# EasyEDA Pro project osc_gener.eprj, board 示波发生
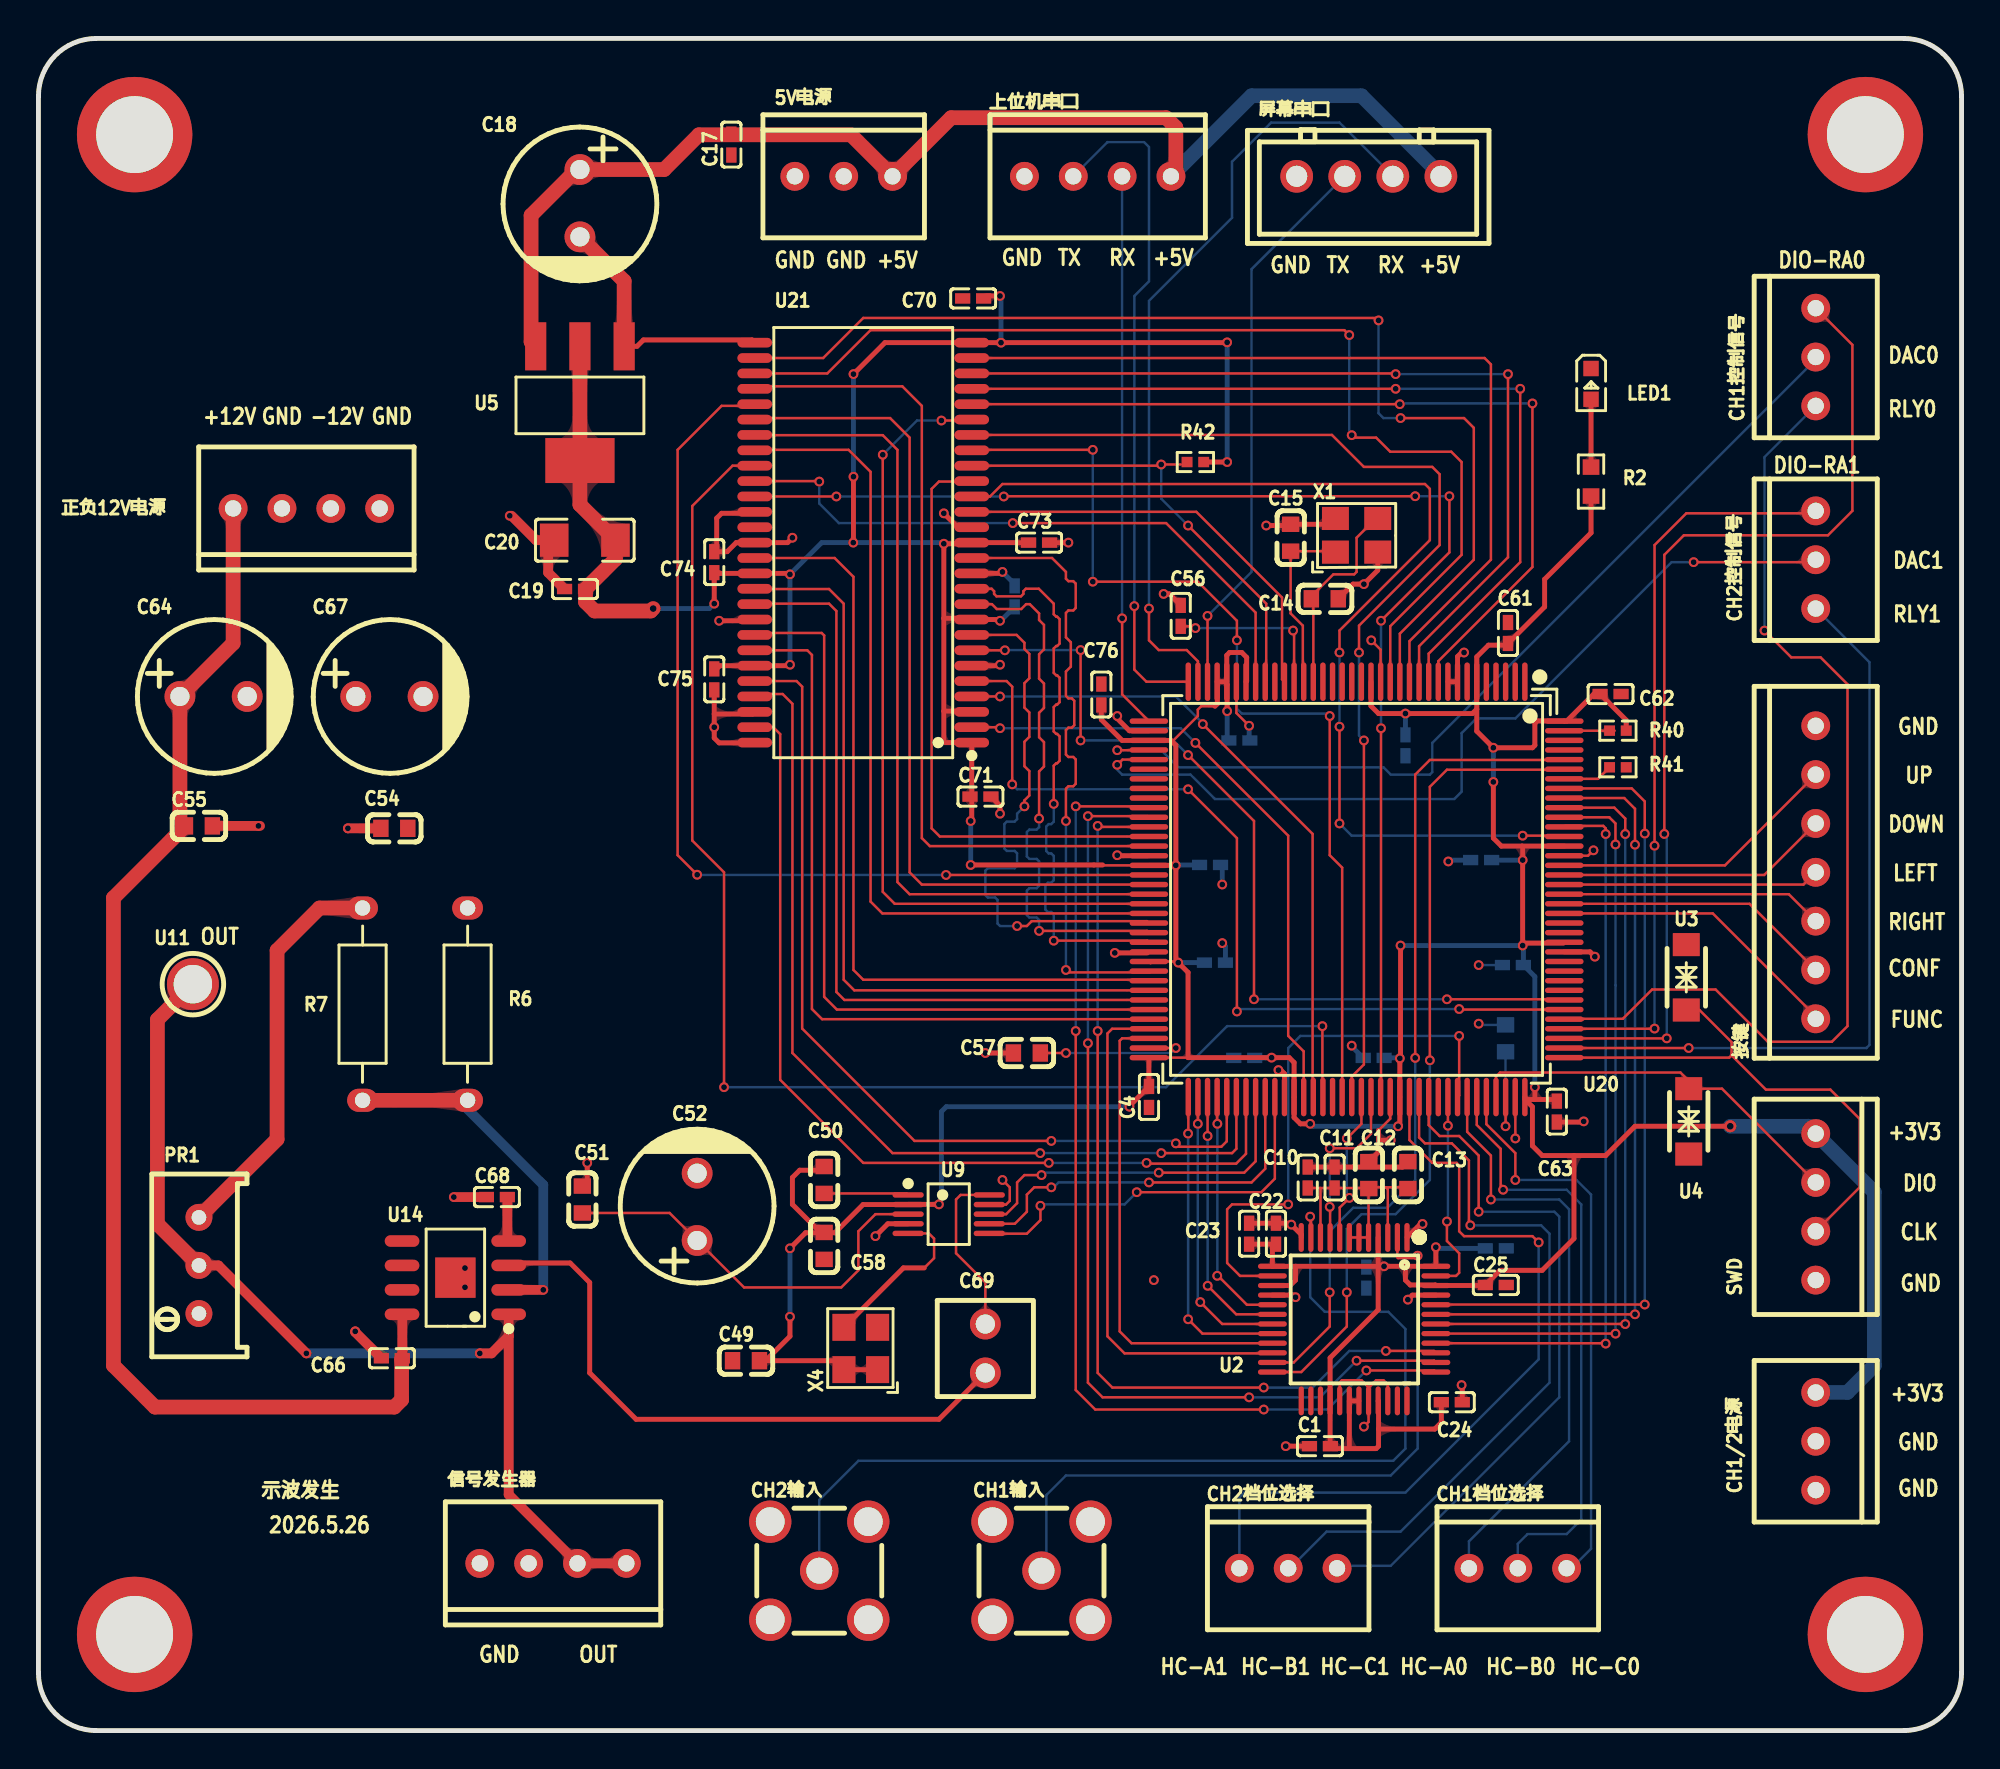
[diagram p8: board, top side]
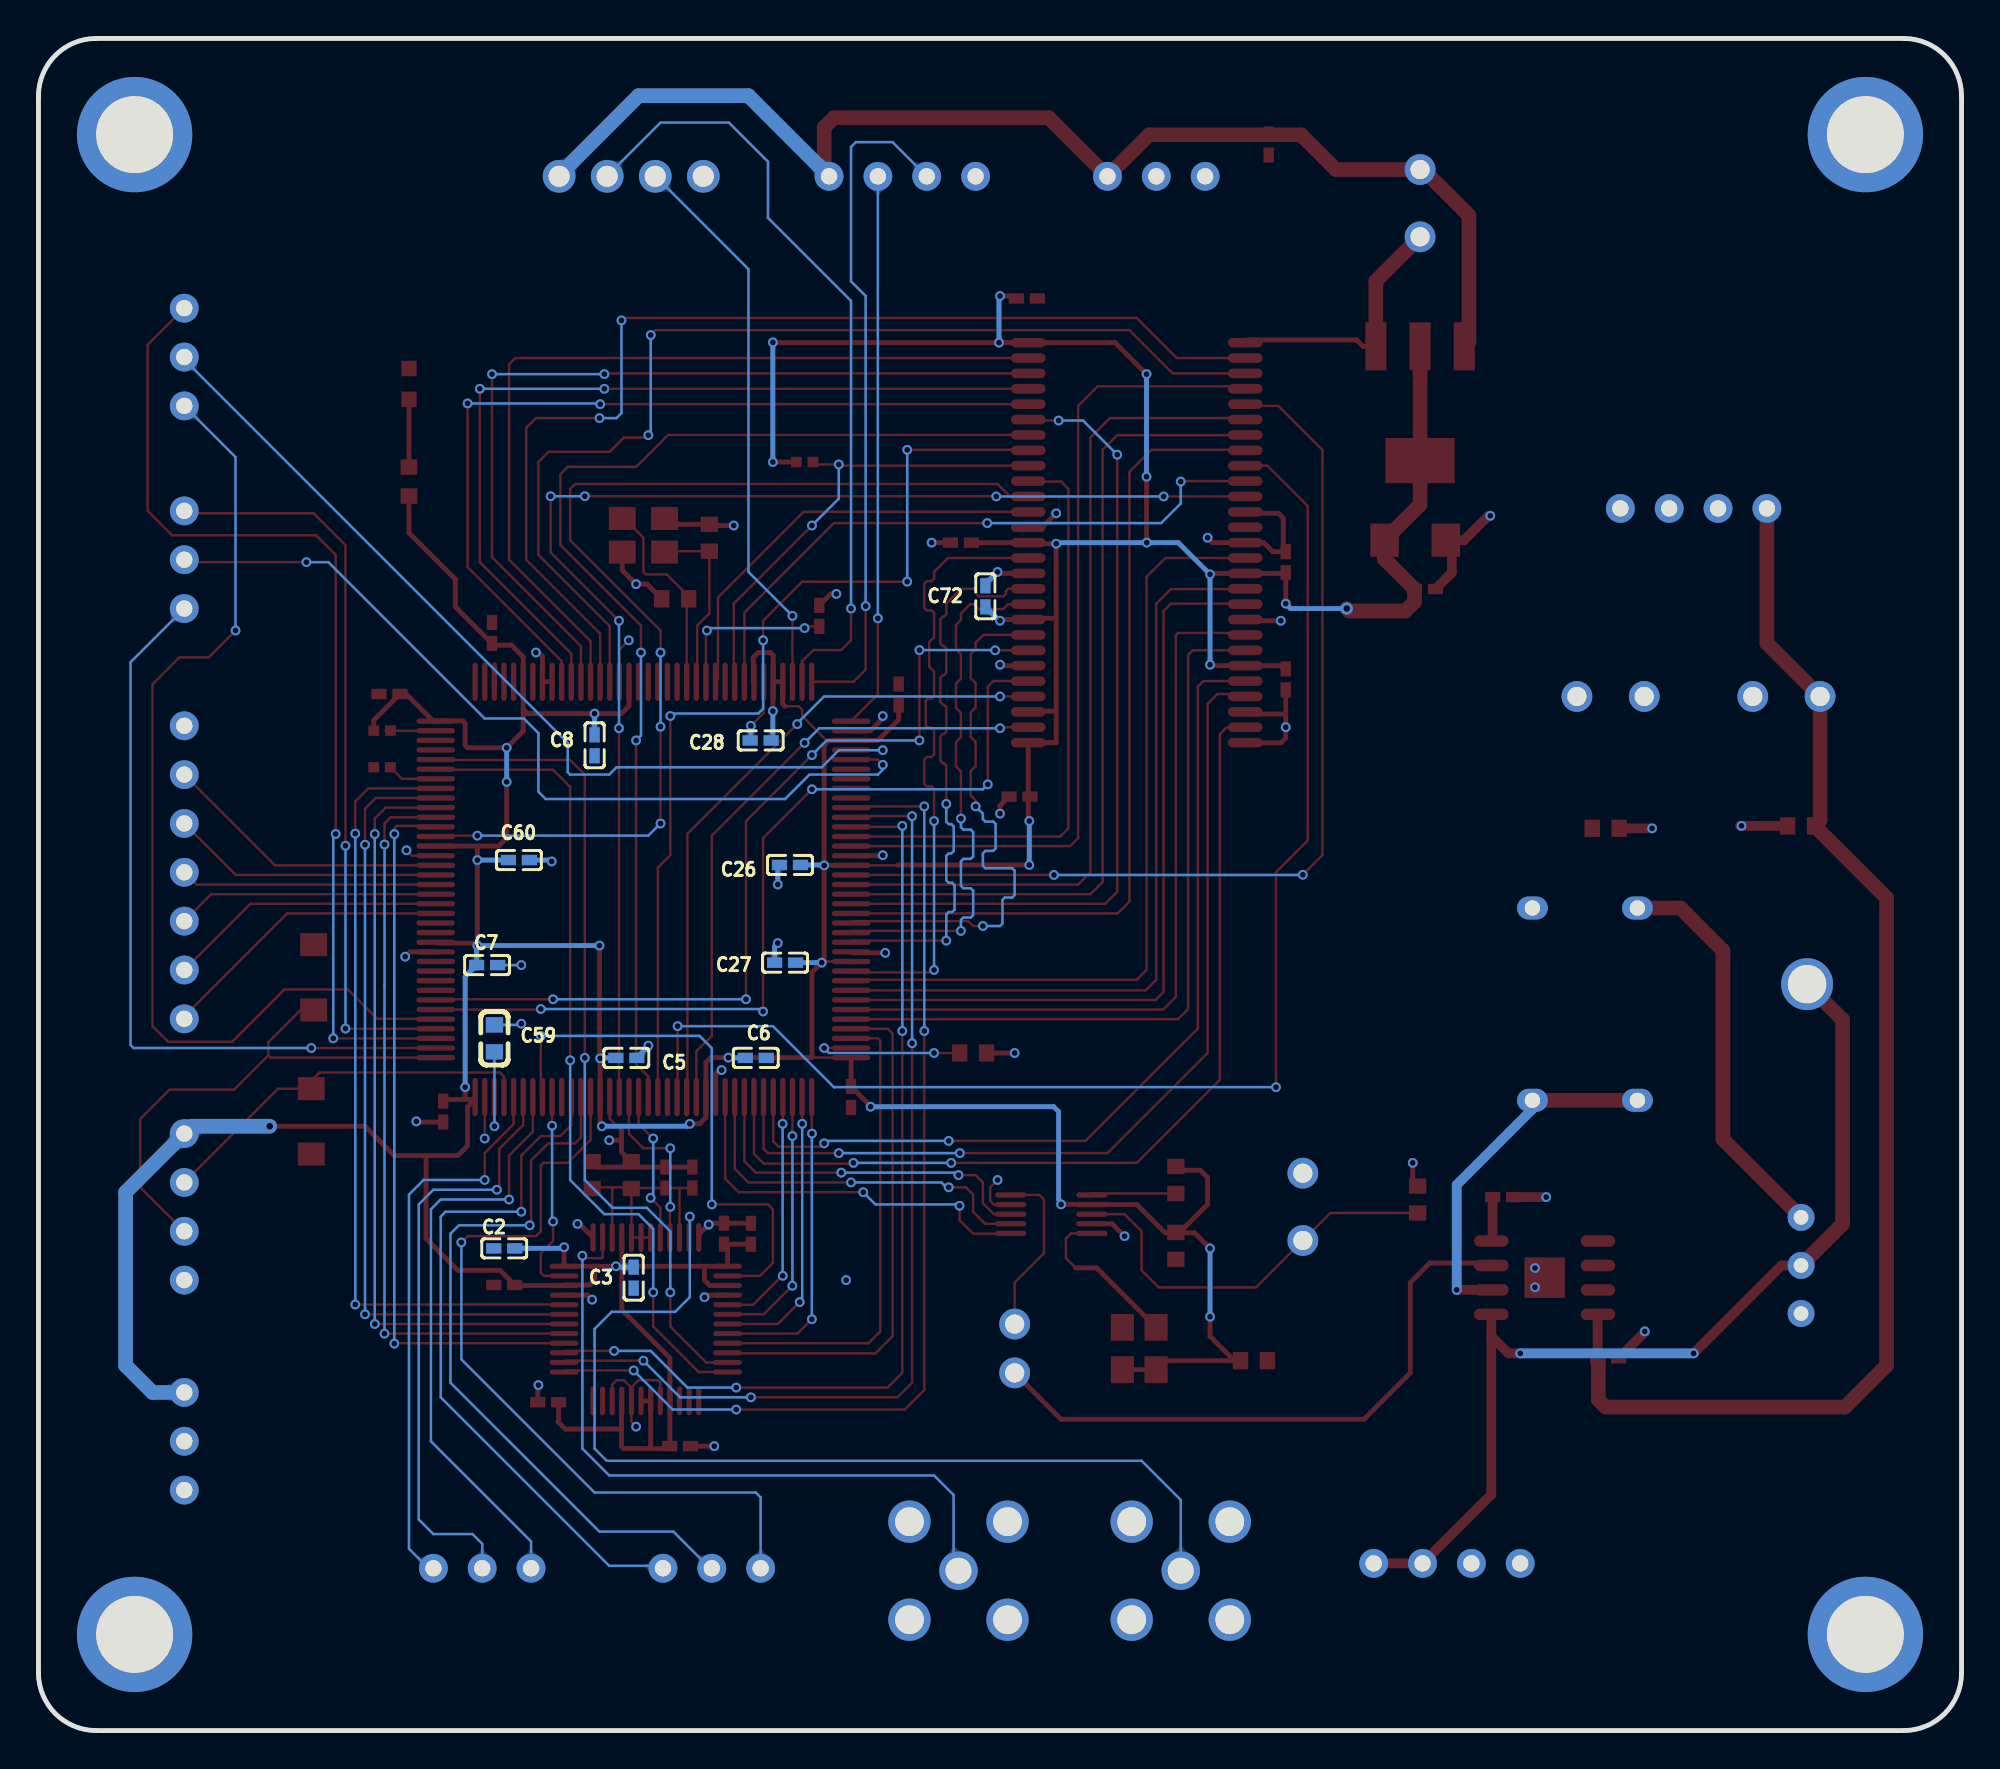
[diagram p9: board, bottom side, seen from below]

Outline 100 x 88 mm; copper layers: Top Layer, Bottom Layer. Coordinates in mm from the lower left corner of the outline.
Outline path: 0,85 0,3 arc(0.88,0.88) 3,0 97,0 arc(99.12,0.88) 100,3 100,85 arc(99.12,87.12) 97,88 3,88 arc(0.88,87.12) 0,85
Stack: Top Layer 0.035mm / Dielectric1 1.51mm FR4 er 4.5 / Bottom Layer 0.035mm

## Design rules (mm)
template: 自定义配置
spacing copperThickness1oz (default): track to track 0.203, other pairs 0.152 to 0.3
spacing copperThickness2oz: track to track 0.203, other pairs 0.152 to 0.3
track width copperThickness1oz (default): min 0.127, default 0.254, max 2.54
track width copperThickness2oz: min 0.203, default 0.254, max 2.54
track width VCCandGND: min 0.127, default 0.762, max 2.54
differential pair differentialPair (default): width min 0.127, default 0.254, max 2.54; gap min 0.152, default 0.152
via viaSize (default): diameter min 0.5, default 0.61, max 10; hole min 0.3, default 0.305, max 6.299

## Placement (name value [footprint] x y rotation side)
5V电源  -  [CH2.54-3插座]  41.87 80.83 0 top
C1  100nF  [C0402]  66.64 14.79 0 top
C2  100nF  [C0402]  75.78 25.08 180 bottom
C3  100nF  [C0402]  69.05 23.55 90 bottom
C4  100nF  [C0402]  57.75 32.95 90 top
C5  100nF  [C0402]  69.43 34.98 0 bottom
C6  100nF  [C0402]  62.7 34.98 0 bottom
C7  100nF  [C0402]  76.67 39.81 0 bottom
C8  100nF  [C0402]  71.08 51.24 90 bottom
C10  100nF  [C0402]  66 28.76 270 top
C11  100nF  [C0402]  67.4 28.76 270 top
C12  22uF  [C0603]  69.18 28.89 270 top
C13  22uF  [C0603]  71.21 28.89 270 top
C14  22pF  [C0603]  66.89 58.86 180 top
C15  22pF  [C0603]  65.11 62.03 270 top
C17  100nF  [C0402]  36.03 82.48 90 top
C18  1000uF  [cap-th_bd8.0-p3.50-d0.6-fd_1]  28.16 79.43 270 top
C19  100nF  [C0402]  27.9 59.37 0 top
C20  100uF  [C1206]  28.41 61.91 0 top
C22  100nF  [C0402]  64.35 25.84 270 top
C23  100nF  [C0402]  62.95 25.84 270 top
C24  100nF  [C0402]  73.5 17.08 180 top
C25  100nF  [C0402]  75.78 23.17 180 top
C26  100nF  [C0402]  60.92 45.02 180 bottom
C27  100nF  [C0402]  61.18 39.94 180 bottom
C28  100nF  [C0402]  62.45 51.49 180 bottom
C49  100nF  [C0603]  36.79 19.24 0 top
C50  10nF  [C0603]  40.86 28.63 90 top
C51  100nF  [C0603]  28.28 27.62 270 top
C52  100uF  [CAP-TH_BD8.0-P3.50-D0.6-FD_1]  34.25 27.24 90 top
C54  100nF  [C0603]  18.5 46.92 180 top
C55  100nF  [C0603]  8.34 47.05 0 top
C56  100nF  [C0402]  59.4 57.97 90 top
C57  4.7uF  [C0603]  51.4 35.24 0 top
C58  1uF  [C0603]  40.86 25.2 270 top
C59  4.7uF  [C0603]  76.29 36 270 bottom
C60  100nF  [C0402]  75.02 45.27 0 bottom
C61  100nF  [C0402]  76.42 57.08 270 top
C62  100nF  [C0402]  81.75 53.91 180 top
C63  100nF  [C0402]  78.96 32.19 90 top
C64  470uF  [cap-th_bd8.0-p3.50-d0.6-fd_1]  9.11 53.78 0 top
C66  100nF  [C0402]  18.38 19.36 180 top
C67  470uF  [cap-th_bd8.0-p3.50-d0.6-fd_1]  18.25 53.78 0 top
C68  100nF  [C0402]  23.84 27.74 0 top
C69  10uF  [CAP-TH_L5.0-W5.0-P2.54-D1.0]  49.24 19.87 90 top
C70  100nF  [C0402]  48.6 74.48 180 top
C71  100nF  [C0402]  48.98 48.57 0 top
C72  100nF  [C0402]  50.76 58.99 90 bottom
C73  100nF  [C0402]  52.03 61.78 0 top
C74  100nF  [C0402]  35.14 60.76 90 top
C75  100nF  [C0402]  35.14 54.67 270 top
C76  100nF  [C0402]  55.27 53.88 270 top
CH1/2电源  -  [CH2.54-3插座]  92.42 15.04 270 top
CH1控制信号  -  [CH2.54-3插座]  92.42 71.43 90 top
CH1档位选择  -  [CH2.54-3插座]  76.92 8.44 0 top
CH1输入  BWSMA-KE-Z001  [SMA-TH_BWSMA-KE-Z001]  52.16 8.31 0 top
CH2控制信号  -  [CH2.54-3插座]  92.42 60.89 90 top
CH2档位选择  -  [CH2.54-3插座]  64.99 8.44 0 top
CH2输入  BWSMA-KE-Z001  [SMA-TH_BWSMA-KE-Z001]  40.6 8.31 0 top
LED1  KT-0603R  [LED0603-RD]  80.73 70.03 270 top
NOREF  -  [Pad_e109]  5 83 0 top
NOREF#2  -  [Pad_e108]  95 83 0 top
NOREF#3  -  [Pad_e111]  95 5 0 top
NOREF#4  -  [Pad_e110]  5 5 0 top
PR1  10kΩ  [RES-ADJ-TH_3P-L9.5-W4.9-P2.50]  8.34 24.19 180 top
R2  5.1kΩ  [R0603]  80.73 64.95 90 top
R6  1kΩ  [240*80mil]  22.31 37.78 90 top
R7  9kΩ  [240*80mil]  16.85 37.78 270 top
R40  10kΩ  [R0402]  82.13 52 0 top
R41  10kΩ  [R0402]  82.13 50.1 0 top
R42  10kΩ  [R0402]  60.16 65.97 180 top
SWD  SWD  [CH2.54-4插座]  92.42 27.24 270 top
U2  AD9288BSTZ-100  [LQFP-48_L7.0-W7.0-P0.50-LS9.0-BL]  68.41 21.39 180 top
U3  SMF7.5CA  [SOD-123FL_L2.8-W1.8-LS3.7-BI]  85.69 39.17 90 top
U4  SMF7.5CA  [SOD-123FL_L2.8-W1.8-LS3.7-BI]  85.81 31.68 270 top
U5  AMS1117-3.3  [SOT-223-3_L6.5-W3.4-P2.30-LS7.0-BR]  28.16 69.02 90 top
U9  AD9833BRMZ-REEL7  [MSOP-10_L3.0-W3.0-P0.50-LS5.0-BL]  47.33 26.86 270 top
U11  TP-黄色测试点  [TESTPOINT-TH_BD3.2]  8.03 38.82 0 top
U14  AD8397ARDZ-REEL7  [sop-8_l4.9-w3.9-p1.27-ls6.0-bl-ep2.1]  21.68 23.55 90 top
U20  STM32H743ZGT6  [LQFP-144_L20.0-W20.0-P0.50-LS22.0-BL]  68.54 43.75 180 top
U21  W9825G6KH-6I  [TSOP-54_L22.2-W10.2-P0.80-LS11.8-BL]  42.89 61.78 90 top
X1  25MHz  [OSC-SMD_4P-L3.2-W2.5-BL]  68.54 62.16 0 top
X4  25MHz  [OSC-SMD_4P-L3.2-W2.5-BL]  42.76 19.87 90 top
上位机串口  -  [CH2.54-4插座]  55.08 80.83 0 top
信号发生器  输出  [CH2.54-4插座]  26.76 8.69 180 top
屏幕串口  XH-2.54-4  [CONN-TH_XH-2.54-4]  69.18 80.83 180 top
按键  -  [CH2.54-7插座]  92.42 44.64 90 top
正负12V电源  -  [CH2.54-4插座]  13.93 63.56 180 top

## Footprints (pads in the part's own frame, mm; a bottom-side part is the same pattern mirrored in y, then rotated)
240*80mil
  oval 1.2x1.6 hole 0.8: 1(-5,0) 2(5,0)
C0402
  rect 0.79x0.54 smd: 1(-0.545,0) 2(0.545,0)
C0603
  rect 0.8x0.9 smd: 1(-0.7,0) 2(0.7,0)
C1206
  rect 1.485x1.728 smd: 1(-1.593,0) 2(1.593,0)
CAP-TH_BD8.0-P3.50-D0.6-FD_1
  round 1.6 hole 1: 1(-1.75,0) 2(1.75,0)
cap-th_bd8.0-p3.50-d0.6-fd_1
  round 1.6 hole 1: 1(-1.75,0) 2(1.75,0)
CAP-TH_L5.0-W5.0-P2.54-D1.0
  round 1.6 hole 1: 1(-1.27,0) 2(1.27,0)
CH2.54-3插座
  round 1.5 hole 0.85: 1(-2.54,0) 2(0,0) 3(2.54,0)
CH2.54-4插座
  round 1.5 hole 0.85: 1(-3.81,0) 2(-1.27,0) 3(1.27,0) 4(3.81,0)
CH2.54-7插座
  round 1.5 hole 0.85: 1(-7.62,0) 2(-5.08,0) 3(-2.54,0) 4(0,0) 5(2.54,0) 6(5.08,0) 7(7.62,0)
CONN-TH_XH-2.54-4
  round 1.7 hole 1.1: 1(-3.75,0) 2(-1.25,0) 3(1.25,0) 4(3.75,0)
LED0603-RD
  rect 0.8x0.8 smd: 1(-0.799,0) 2(0.799,0)
LQFP-48_L7.0-W7.0-P0.50-LS9.0-BL
  oval 0.27x1.5 smd: 1(-2.75,-4.25) 2(-2.25,-4.25) 3(-1.75,-4.25) 4(-1.25,-4.25) 5(-0.75,-4.25) 6(-0.25,-4.25) 7(0.25,-4.25) 8(0.75,-4.25) 9(1.25,-4.25) 10(1.75,-4.25) 11(2.25,-4.25) 12(2.75,-4.25) 25(2.75,4.25) 26(2.25,4.25) 27(1.75,4.25) 28(1.25,4.25) 29(0.75,4.25) 30(0.25,4.25) 31(-0.25,4.25) 32(-0.75,4.25) 33(-1.25,4.25) 34(-1.75,4.25) 35(-2.25,4.25) 36(-2.75,4.25)
  oval 1.5x0.27 smd: 13(4.25,-2.75) 14(4.25,-2.25) 15(4.25,-1.75) 16(4.25,-1.25) 17(4.25,-0.75) 18(4.25,-0.25) 19(4.25,0.25) 20(4.25,0.75) 21(4.25,1.25) 22(4.25,1.75) 23(4.25,2.25) 24(4.25,2.75) 37(-4.25,2.75) 38(-4.25,2.25) 39(-4.25,1.75) 40(-4.25,1.25) 41(-4.25,0.75) 42(-4.25,0.25) 43(-4.25,-0.25) 44(-4.25,-0.75) 45(-4.25,-1.25) 46(-4.25,-1.75) 47(-4.25,-2.25) 48(-4.25,-2.75)
LQFP-144_L20.0-W20.0-P0.50-LS22.0-BL
  oval 0.28x2 smd: 1(-8.75,-10.8) 2(-8.25,-10.8) 3(-7.75,-10.8) 4(-7.25,-10.8) 5(-6.75,-10.8) 6(-6.25,-10.8) 7(-5.75,-10.8) 8(-5.25,-10.8) 9(-4.75,-10.8) 10(-4.25,-10.8) 11(-3.75,-10.8) 12(-3.25,-10.8) 13(-2.75,-10.8) 14(-2.25,-10.8) 15(-1.75,-10.8) 16(-1.25,-10.8) 17(-0.75,-10.8) 18(-0.25,-10.8) 19(0.25,-10.8) 20(0.75,-10.8) 21(1.25,-10.8) 22(1.75,-10.8) 23(2.25,-10.8) 24(2.75,-10.8) 25(3.25,-10.8) 26(3.75,-10.8) 27(4.25,-10.8) 28(4.75,-10.8) 29(5.25,-10.8) 30(5.75,-10.8) 31(6.25,-10.8) 32(6.75,-10.8) 33(7.25,-10.8) 34(7.75,-10.8) 35(8.25,-10.8) 36(8.75,-10.8) 73(8.75,10.8) 74(8.25,10.8) 75(7.75,10.8) 76(7.25,10.8) 77(6.75,10.8) 78(6.25,10.8) 79(5.75,10.8) 80(5.25,10.8) 81(4.75,10.8) 82(4.25,10.8) 83(3.75,10.8) 84(3.25,10.8) 85(2.75,10.8) 86(2.25,10.8) 87(1.75,10.8) 88(1.25,10.8) 89(0.75,10.8) 90(0.25,10.8) 91(-0.25,10.8) 92(-0.75,10.8) 93(-1.25,10.8) 94(-1.75,10.8) 95(-2.25,10.8) 96(-2.75,10.8) 97(-3.25,10.8) 98(-3.75,10.8) 99(-4.25,10.8) 100(-4.75,10.8) 101(-5.25,10.8) 102(-5.75,10.8) 103(-6.25,10.8) 104(-6.75,10.8) 105(-7.25,10.8) 106(-7.75,10.8) 107(-8.25,10.8) 108(-8.75,10.8)
  oval 2x0.28 smd: 37(10.8,-8.75) 38(10.8,-8.25) 39(10.8,-7.75) 40(10.8,-7.25) 41(10.8,-6.75) 42(10.8,-6.25) 43(10.8,-5.75) 44(10.8,-5.25) 45(10.8,-4.75) 46(10.8,-4.25) 47(10.8,-3.75) 48(10.8,-3.25) 49(10.8,-2.75) 50(10.8,-2.25) 51(10.8,-1.75) 52(10.8,-1.25) 53(10.8,-0.75) 54(10.8,-0.25) 55(10.8,0.25) 56(10.8,0.75) 57(10.8,1.25) 58(10.8,1.75) 59(10.8,2.25) 60(10.8,2.75) 61(10.8,3.25) 62(10.8,3.75) 63(10.8,4.25) 64(10.8,4.75) 65(10.8,5.25) 66(10.8,5.75) 67(10.8,6.25) 68(10.8,6.75) 69(10.8,7.25) 70(10.8,7.75) 71(10.8,8.25) 72(10.8,8.75) 109(-10.8,8.75) 110(-10.8,8.25) 111(-10.8,7.75) 112(-10.8,7.25) 113(-10.8,6.75) 114(-10.8,6.25) 115(-10.8,5.75) 116(-10.8,5.25) 117(-10.8,4.75) 118(-10.8,4.25) 119(-10.8,3.75) 120(-10.8,3.25) 121(-10.8,2.75) 122(-10.8,2.25) 123(-10.8,1.75) 124(-10.8,1.25) 125(-10.8,0.75) 126(-10.8,0.25) 127(-10.8,-0.25) 128(-10.8,-0.75) 129(-10.8,-1.25) 130(-10.8,-1.75) 131(-10.8,-2.25) 132(-10.8,-2.75) 133(-10.8,-3.25) 134(-10.8,-3.75) 135(-10.8,-4.25) 136(-10.8,-4.75) 137(-10.8,-5.25) 138(-10.8,-5.75) 139(-10.8,-6.25) 140(-10.8,-6.75) 141(-10.8,-7.25) 142(-10.8,-7.75) 143(-10.8,-8.25) 144(-10.8,-8.75)
MSOP-10_L3.0-W3.0-P0.50-LS5.0-BL
  oval 0.28x1.62 smd: 1(-1,-2.11) 2(-0.5,-2.11) 3(0,-2.11) 4(0.5,-2.11) 5(1,-2.11) 6(1,2.11) 7(0.5,2.11) 8(0,2.11) 9(-0.5,2.11) 10(-1,2.11)
OSC-SMD_4P-L3.2-W2.5-BL
  rect 1.4x1.2 smd: 1(-1.1,-0.875) 2(1.1,-0.875) 3(1.1,0.875) 4(-1.1,0.875)
Pad_e108
  round 6 hole 4: 2(0,0)
Pad_e109
  round 6 hole 4: 2(0,0)
Pad_e110
  round 6 hole 4: 2(0,0)
Pad_e111
  round 6 hole 4: 2(0,0)
R0402
  rect 0.566x0.54 smd: 1(-0.433,0) 2(0.433,0)
R0603
  rect 0.806x0.864 smd: 1(-0.753,0) 2(0.753,0)
RES-ADJ-TH_3P-L9.5-W4.9-P2.50
  round 1.4 hole 0.762: 1(0,2.5) 2(0,0) 3(0,-2.5)
SMA-TH_BWSMA-KE-Z001
  round 2.2 hole 1.5: 1(-2.55,-2.55) 2(-2.55,2.55) 3(2.55,2.55) 4(2.55,-2.55)
  round 2 hole 1.35: 5(0,0)
SOD-123FL_L2.8-W1.8-LS3.7-BI
  rect 1.2x1.4 smd: 1(-1.7,0) 2(1.7,0)
sop-8_l4.9-w3.9-p1.27-ls6.0-bl-ep2.1
  oval 0.6x1.8 smd: 1(-1.905,-2.772) 2(-0.635,-2.772) 3(0.635,-2.772) 4(1.905,-2.772) 5(1.905,2.772) 6(0.635,2.772) 7(-0.635,2.772) 8(-1.905,2.772)
  rect 2.1x2.1 smd: 9(0,0)
SOT-223-3_L6.5-W3.4-P2.30-LS7.0-BR
  rect 2.5x1.1 smd: 1(2.97,-2.3) 2(2.97,0) 3(2.97,2.3)
  rect 2.34x3.6 smd: 4(-2.97,0)
TESTPOINT-TH_BD3.2
  round 2.7 hole 2: 1(0,0)
TSOP-54_L22.2-W10.2-P0.80-LS11.8-BL
  oval 0.5x1.8 smd: 1(-10.4,-5.642) 2(-9.6,-5.642) 3(-8.8,-5.642) 4(-8,-5.642) 5(-7.2,-5.642) 6(-6.4,-5.642) 7(-5.6,-5.642) 8(-4.8,-5.642) 9(-4,-5.642) 10(-3.2,-5.642) 11(-2.4,-5.642) 12(-1.6,-5.642) 13(-0.8,-5.642) 14(0,-5.642) 15(0.8,-5.642) 16(1.6,-5.642) 17(2.4,-5.642) 18(3.2,-5.642) 19(4,-5.642) 20(4.8,-5.642) 21(5.6,-5.642) 22(6.4,-5.642) 23(7.2,-5.642) 24(8,-5.642) 25(8.8,-5.642) 26(9.6,-5.642) 27(10.4,-5.642) 28(10.4,5.642) 29(9.6,5.642) 30(8.8,5.642) 31(8,5.642) 32(7.2,5.642) 33(6.4,5.642) 34(5.6,5.642) 35(4.8,5.642) 36(4,5.642) 37(3.2,5.642) 38(2.4,5.642) 39(1.6,5.642) 40(0.8,5.642) 41(0,5.642) 42(-0.8,5.642) 43(-1.6,5.642) 44(-2.4,5.642) 45(-3.2,5.642) 46(-4,5.642) 47(-4.8,5.642) 48(-5.6,5.642) 49(-6.4,5.642) 50(-7.2,5.642) 51(-8,5.642) 52(-8.8,5.642) 53(-9.6,5.642) 54(-10.4,5.642)

## Nets
As in the schematic, except:
+3V3: C1.2 C2.2 C3.2 C4.2 C5.2 C6.2 C7.2 C8.2 C19.2 C20.2 C22.2 C23.2 C24.2 C25.2 C26.2 C27.2 C28.2 C49.2 C50.2 C58.1 C60.2 C61.2 C62.2 C63.2 C70.1 C71.1 C72.1 C73.1 C74.1 C75.1 C76.2 CH1/2电源.1 R2.1 R40.2 R42.1 SWD.1 U2.4 U2.13 U2.15 U2.28 U2.30 U2.31 U2.33 U2.46 U2.48 U5.2 U5.4 U9.2 U20.6 U20.17 U20.30 U20.32 U20.33 U20.39 U20.52 U20.62 U20.72 U20.84 U20.95 U20.108 U20.121 U20.131 U20.144 U21.1 U21.3 U21.9 U21.14 U21.27 U21.43 U21.49 X4.1 X4.4
GND: 5V电源.1 5V电源.2 C1.1 C2.1 C3.1 C4.1 C5.1 C6.1 C7.1 C8.1 C10.1 C11.1 C12.1 C13.1 C14.1 C15.1 C17.1 C18.2 C19.1 C20.1 C22.1 C23.1 C24.1 C25.1 C26.1 C27.1 C28.1 C49.1 C51.1 C52.2 C54.2 C55.2 C56.2 C57.1 C58.2 C59.1 C60.1 C61.1 C62.1 C63.1 C64.2 C66.2 C67.1 C68.1 C70.2 C71.2 C72.2 C73.2 C74.2 C75.2 C76.1 CH1/2电源.2 CH1/2电源.3 CH1输入.1 CH1输入.2 CH1输入.3 CH1输入.4 CH2输入.1 CH2输入.2 CH2输入.3 CH2输入.4 LED1.1 NOREF.2 NOREF#2.2 NOREF#3.2 NOREF#4.2 R6.2 R41.2 SWD.4 U2.1 U2.12 U2.16 U2.27 U2.29 U2.32 U2.34 U2.45 U3.2 U4.2 U5.1 U9.4 U9.9 U20.8 U20.9 U20.16 U20.31 U20.38 U20.51 U20.61 U20.83 U20.94 U20.107 U20.120 U20.130 U21.6 U21.12 U21.15 U21.28 U21.39 U21.41 U21.46 U21.52 U21.54 X1.2 X1.4 X4.2 上位机串口.1 信号发生器.3 信号发生器.4 屏幕串口.4 按键.7 正负12V电源.1 正负12V电源.3
CLK: SWD.3 U3.1 U20.109
DIO: SWD.2 U4.1 U20.105
HC-A0: CH1档位选择.1 U20.102
HC-A1: CH2档位选择.1 U20.96
HC-C0: CH1档位选择.3 U20.104
HC-C1: CH2档位选择.3 U20.98
$3N6866: PR1.2 U11.1 U14.1 信号发生器.1 信号发生器.2

Pads without a net: PR1 1; U2 25 26 35 36; U14 5 6 7; U20 1 2 3 4 5 7 18 19 20 21 22 27 42 43 44 45 88 99 116 117 118 119 122 123 141 142; U21 40

## Via types
v1: diameter 0.508, hole 0.305, Top Layer to Bottom Layer, 223 vias
v2: diameter 0.635, hole 0.355, Top Layer to Bottom Layer, 2 vias

## Routing (per net, layer and track width the routed paths; a pad name or vN(x,y) marks a point on that pad's centre or on a via; arc(x,y) is an arc through that point)
+3V3: length 392.7
  Top Layer w0.127: 61.18,53.27 60.46,53.27 60.29,53.09 60.29,52.76 59.02,51.49 58.89,51.49 ; 57.83,39.91 57.92,40 59.14,40 ; 54.88,45.02 54.9,45 U20.52 ; 59.78,35 U20.72
  Top Layer w0.254: C63.2 78.87,32.82 77.81,32.82 ; 69.69,15.68 72.61,15.68 72.99,16.06 72.95,16.1 C24.2 ; 69.69,15.68 69.69,17.12 U2.33 ; 69.69,15.68 69.69,14.79 69.56,14.66 68.14,14.66 ; v1(39.08,25.08) 39.89,25.89 40.68,25.89 ; 74.79,53.12 74.56,52.89 v1(71.08,52.89) 69.69,52.89 69.29,53.28 U20.17 ; 74.79,53.12 U20.6 74.79,55.84 75.4,56.45 76.33,56.45 C61.2 78.32,58.44 78.32,59.88 80.73,62.29 R2.1 ; 74.79,53.12 74.79,51.97 v1(75.65,51.11) 77.69,51.11 77.81,51.24 77.81,52.38 77.94,52.51 79.33,52.51 U20.144 79.47,52.5 80.88,53.91 C62.2 82.56,52.55 R40.2 ; v1(50,57.72) 49.94,57.78 U21.9 48.47,57.84 47.08,57.84 ; C76.2 55.27,52.57 56.35,51.49 57.75,51.49 ; 55.33,45.02 v1(48.48,45.02) ; 64.16,25.29 U2.13 65.38,24.14 ; 64.16,25.29 C22.2 ; 64.16,25.29 C23.2 ; 57.75,51.49 U20.39 ; 57.75,51.49 58.89,51.49 59.14,51.24 59.14,45.02 59.12,45 ; 65.38,24.14 65.37,24.13 65.37,23.43 65.09,23.14 U2.15 ; 65.38,24.14 69.66,24.14 ; 77.15,46 77.18,45.97 v1(77.18,45.27) v1(77.18,40.83) 77.31,40.95 79.3,40.95 ; 77.15,46 U20.131 ; 77.15,46 76.07,46 75.65,46.41 v1(75.65,49.33) ; 68.14,14.66 68.16,14.69 U2.30 U2.31 ; 68.14,14.66 67.27,14.66 67.16,14.77 U2.28 67.16,19.38 69.66,21.88 69.66,24.14 ; v2(87.97,31.43) 83.02,31.43 81.5,29.9 79.84,29.9 ; v1(39.08,55.43) 39.03,55.38 U21.49 35.44,55.38 35.27,55.21 ; 47.08,53.02 47.08,51.39 47.06,51.38 U21.1 48.53,47.36 v1(48.48,47.3) ; 47.08,53.02 47.08,57.84 ; 47.08,53.02 48.49,53.02 U21.3 ; 71.08,24.14 71.08,23.43 71.34,23.17 72.64,23.17 U2.46 75.21,23.14 C25.2 76,23.93 78.19,23.93 79.84,25.59 79.84,29.9 ; 71.08,24.14 U2.48 v1(72.66,25.14) ; 71.08,24.14 v1(69.97,24.14) 69.66,24.14 ; v1(56.73,32.44) 56.73,32.48 C4.2 57.74,33.5 57.74,34.87 ; 77.81,32.82 v1(77.81,33.46) ; 77.81,32.82 77.31,32.82 ; 69.66,24.14 U2.4 ; v1(39.08,21.52) 39.08,20.5 37.81,19.24 ; U20.108 77.31,32.93 77.31,32.82 ; 79.84,29.9 78.19,29.9 77.69,30.41 77.69,32.44 77.31,32.82 ; C73.1 U21.14 48.47,61.72 v1(47.08,61.72) 47.08,57.84 ; 59.12,45 v1(59.14,45) 59.14,40 59.2,39.94 v1(59.27,39.94) 59.78,39.43 59.78,35 v1(64.12,35) 65.04,35 65.29,34.74 U20.84 65.29,31.88 65.62,31.55 v1(66.13,31.55) ; 59.12,45 U20.52 ; 40.68,25.89 39.21,27.36 39.21,28.76 39.59,29.14 40.79,29.14 40.98,29.33 ; 40.68,25.89 41.41,25.89 42.88,27.36 45.22,27.36 45.23,27.36 v1(46.82,27.36) ; v1(50,74.61) 49.28,74.61 ; v1(70.83,40.83) 70.83,34.99 v1(70.79,34.96) U20.95 70.79,31.52 v1(70.7,31.43) ; 61.79,54.42 61.81,54.4 v1(61.81,53.02) ; 35.4,60.22 35.43,60.18 U21.43 39.03,60.18 v1(39.08,60.13) ; R42.1 v1(61.81,65.97) ; 37.81,19.24 C49.2 ; 37.81,19.24 41.42,19.24 X4.4 X4.1 ; C74.1 v1(35.14,58.61) ; 61.18,53.27 61.3,53.4 61.3,54.53 U20.33 U20.32 61.79,55.92 61.94,56.06 62.57,56.06 62.83,55.81 62.83,54.58 U20.30 ; v1(61.81,72.19) 61.8,72.18 v1(50.05,72.18) U21.27 44.02,72.18 v1(42.38,70.54) ; v1(42.38,65.21) 42.38,61.78
  Top Layer w0.762: U5.2 U5.4 28.16,63.75 C20.2 30,60.92 C19.2 28.45,58.69 28.92,58.22 31.84,58.22 v2(31.97,58.35)
  Bottom Layer w0.254: v1(70.83,40.83) v1(77.18,40.83) 77.22,40.79 77.22,39.81 77.81,39.21 v1(77.81,33.46) ; v1(70.7,31.43) 66.26,31.43 v1(66.13,31.55) ; v1(50,74.61) 50.05,74.55 v1(50.05,72.18) ; v1(61.81,65.97) v1(61.81,72.19) ; 60.88,39.94 59.4,39.94 ; 47.08,61.78 v1(42.37,61.78) 40.73,61.78 v1(39.08,60.13) v1(39.08,55.43) ; v1(71.08,52.89) 71.08,52.04 ; C6.2 64.11,34.98 v1(64.12,35) ; C3.2 69.94,24.1 ; C72.1 50.04,57.72 v1(50,57.72) ; v1(72.66,25.14) 72.73,25.08 C2.2 ; C60.2 v1(77.18,45.27) ; C26.2 59.14,45.02 ; v1(75.65,51.11) v1(75.65,49.33) ; v1(48.48,45.02) v1(48.48,47.3) ; v2(31.97,58.35) 34.89,58.35 v1(35.14,58.61) ; C5.2 70.83,34.98 ; 46.82,27.49 46.95,27.62 46.95,32.19 47.21,32.44 v1(56.73,32.44) ; v1(42.38,65.21) v1(42.38,70.54) ; v1(39.08,25.08) v1(39.08,21.52) ; 61.81,51.66 v1(61.81,53.02)
  Bottom Layer w0.762: 92.29,17.58 94.07,17.58 95.47,18.98 95.47,28 SWD.1 92.04,31.43 v2(87.97,31.43)
+5V: length 64.8
  Top Layer w0.762: 上位机串口.4 59.14,81.08 59.14,83.37 58.64,83.88 47.46,83.88 5V电源.3 42.25,82.99 34.34,82.99 32.54,81.18 C18.1 28,81.18 25.62,78.8 25.62,72.23 U5.3
  Bottom Layer w0.762: 72.99,80.83 68.8,85.02 63.08,85.02 上位机串口.4
+12V: length 67.9
  Top Layer w0.508: C66.1 18.92,21.63 U14.8
  Top Layer w0.762: C66.1 18.89,19.32 18.89,17.2 18.5,16.82 6.06,16.82 3.9,18.98 3.9,43.3 C55.1 7.36,47.34 C64.1 10.12,56.55 正负12V电源.4
-12V: length 2.3
  Top Layer w0.508: C68.2 24.38,25.53 U14.4
  vias: v1(22.18,24.05) v1(22.18,23.05)
GND: length 122
  Top Layer w0.127: v1(80.86,45.78) 80.58,45.5 U20.130 ; v1(62.95,52.25) 62.29,52.92 62.29,54.42 ; U9.9 50.32,27.36 50.51,27.55 50.51,28.25 v1(50.13,28.63) ; U2.34 70.16,17.99 69.94,18.22 69.56,18.22 69.16,17.83 ; 69.16,17.83 U2.32 69.16,16.05 v1(68.92,15.81) ; 69.16,17.83 69.16,17.85 68.8,18.22 67.78,18.22 67.66,18.1 U2.29 ; v1(76.8,30.79) 76.8,32.94 U20.107 ; 69.69,31.21 70.29,31.82 U20.94 ; U20.16 69.79,56.21 v1(69.3,56.7)
  Top Layer w0.254: C13.1 70.93,29.31 C11.1 C10.1 ; 35.14,52.87 v1(35.14,52.18) 35.14,51.62 35.4,51.37 37.23,51.37 U21.54 ; 35.14,52.87 37.13,52.87 U21.52 ; 35.14,52.87 C75.2 ; C24.1 74.04,17.93 v1(74,17.97) ; v1(64.86,14.79) C1.1 ; v1(55.97,40.44) 57.67,40.44 ; U2.1 71.87,26.35 v1(71.97,26.35) ; v1(50,55.43) 49.95,55.38 U21.6 ; U2.45 71.44,22.64 v1(71.21,22.41) ; U20.83 64.79,34.16 64.6,34.35 ; U21.46 37.18,57.72 v1(35.4,57.72) ; U20.38 56.73,52 56.1,52.63 v1(56.1,52.76) ; U20.51 56.1,45.5 ; v1(49.24,35.24) C57.1 ; v1(28.54,29.52) 28.54,28.57 C51.1 ; C63.1 80.32,31.64 ; X1.2 69.64,60.34 v1(68.92,59.62) 68.35,59.62 67.59,58.86 ; U2.12 65.66,25.79 v1(65.15,26.31) ; v1(47.08,63.3) 47.8,62.58 U21.15 ; U21.28 37.1,72.32 31.46,72.32 31.13,71.99 U5.1 ; U21.12 50.05,60.18 v1(50.13,60.26) ; U20.120 80.68,40.5 80.86,40.32 ; 45.22,26.36 44.17,26.36 v1(43.52,25.71) ; v1(50,47.68) 50,48.1 C71.2 ; 69.69,30.7 v1(70.32,30.7) ; 69.69,30.7 69.69,30.09 C12.1 ; 69.69,30.7 69.69,31.21 ; v1(39.21,62.03) 38.95,61.78 U21.41 36.28,61.78 35.81,61.31 C74.2 35.27,61.44 35.27,63.05 35.52,63.3 37.17,63.3 U21.39 ; v1(53.56,61.78) C73.2 ; C56.2 58.8,59.11 v1(58.51,59.11) ; v1(63.84,62.67) 65.05,62.67 C15.1 67.39,62.73 67.7,63.04 ; U20.9 U20.8 73.79,55.85 74,56.06 ; v1(65.37,22.54) 65.26,22.64 U2.16 ; 65.11,26.35 65.08,26.38 C22.1 C23.1
  Top Layer w0.508: C68.1 21.68,27.74 ; C54.2 v1(16.09,46.92) ; v1(16.47,20.76) 16.47,20.72 C66.2 ; C55.2 11.52,47.05 ; C19.1 26.5,60.22 26.5,61.59 C20.1 25.87,61.91 24.6,63.18
  Top Layer w0.762: C18.2 30.46,75.38 U5.1
  Bottom Layer w0.127: C7.1 v1(74.89,39.81) ; C59.1 74.95,36.7 v1(74.89,36.76)
  Bottom Layer w0.254: C72.2 50.76,59.62 v1(50.13,60.26) ; 61.47,45.02 61.56,44.93 v1(61.56,44) ; v1(61.56,40.95) 61.72,40.79 C27.1 ; v1(68.29,35.62) 68.29,35.58 C5.1 ; C60.1 73.24,45.27 ; v1(62.95,52.25) 62.95,51.53 C28.1
  vias: v1(11.44,47.05) v1(21.6,27.74) v1(24.51,63.18) v1(56.1,45.52) v1(58,23.43) v1(64.48,34.35) v1(73.31,45.2) v1(74.13,56.06) v1(80.35,31.68) v1(80.93,40.25)
AD9833_FSYNC: length 19.1
  Top Layer w0.127: U9.8 50.32,26.86 50.89,27.43 50.89,28.51 51.27,28.89 v1(52.16,28.89) ; U20.80 63.29,29.61 62.7,29.01 v1(58.25,29.01)
  Bottom Layer w0.127: v1(58.25,29.01) 52.16,29.01 52.03,28.89
AD9833_SCLK: length 19.8
  Top Layer w0.127: U20.81 63.79,29.22 63.08,28.51 v1(57.75,28.51) ; v1(52.67,28.25) 51.78,28.25 51.4,27.87 51.4,26.98 50.77,26.36 U9.7
  Bottom Layer w0.127: v1(57.75,28.51) 53.05,28.51 52.79,28.25 v1(52.67,28.25)
AD9833_SDATA: length 20.8
  Top Layer w0.127: 49.44,25.85 49.46,25.84 51.4,25.84 52.1,26.55 v1(52.1,27.29) ; v1(57.11,28) 63.59,28 64.29,28.7 U20.82
  Bottom Layer w0.127: 52.03,27.36 56.48,27.36 v1(57.11,28)
CANCEL: length 15.4
  Top Layer w0.127: U20.124 87.06,42.5 92.42,37.14 按键.1
CH1-OUT: length 36.5
  Top Layer w0.127: v1(71.72,24.7) 71.59,24.57 70.7,24.57 70.66,24.6 U2.2
  Bottom Layer w0.127: v1(71.72,24.7) 71.72,14.66 70.32,13.27 53.43,13.27 52.41,12.25 52.41,8.57 CH1输入.5
CH2-OUT: length 52.4
  Top Layer w0.127: v1(66.13,26.73) 66.16,26.69 U2.11
  Bottom Layer w0.127: v1(66.13,26.73) 66.13,22.54 66.89,21.78 70.19,21.78 71.08,20.89 71.08,14.66 70.45,14.03 42.63,14.03 40.6,12 CH2输入.5
CLK: length 27.3
  Top Layer w0.127: U3.1 86.37,37.47 88.04,35.8 88.04,35.12 ; SWD.3 94.7,28.25 94.7,31.81 93.18,33.33 89.83,33.33 88.04,35.12 ; 88.04,35.12 87.92,35 U20.109
CONFIRM: length 14.5
  Top Layer w0.127: U20.125 88.98,43 按键.2
DA0: length 54.2
  Top Layer w0.127: v1(69.05,18.73) 72.58,18.73 U2.37 ; U20.46 57.67,48.06 v1(53.94,48.06) ; v1(63.72,16.69) 54.95,16.69 53.94,17.71 v1(53.94,36.38)
  Bottom Layer w0.127: v1(63.72,16.69) 67.02,16.69 v1(69.05,18.73) ; v1(53.94,36.38) v1(53.94,48.06)
DA1: length 51.9
  Top Layer w0.127: v1(62.95,17.33) 55.33,17.33 54.57,18.09 v1(54.57,35.75) ; U2.38 72.57,19.24 v1(68.54,19.24) ; v1(54.57,47.56) 57.68,47.56 U20.47
  Bottom Layer w0.127: v1(54.57,35.75) v1(54.57,47.56) ; v1(62.95,17.33) 66.64,17.33 v1(68.54,19.24)
DA2: length 49.9
  Top Layer w0.127: U2.39 72.57,19.74 v1(70.07,19.74) ; v1(63.72,17.84) 55.84,17.84 55.08,18.6 v1(55.08,36.38) ; U20.48 55.13,47 v1(55.08,47.05)
  Bottom Layer w0.127: v1(63.72,17.84) 66.26,17.84 68.16,19.74 v1(70.07,19.74) ; v1(55.08,36.38) v1(55.08,47.05)
DA3: length 37.9
  Top Layer w0.127: U20.133 79.39,47.05 81.37,47.05 81.5,46.92 v1(81.5,46.62) ; U2.40 81.48,20.14 v1(81.5,20.12)
  Bottom Layer w0.127: v1(81.5,46.62) v1(81.5,20.12)
DA4: length 38.7
  Top Layer w0.127: v1(82,46.08) 82,47.17 81.68,47.5 U20.134 ; U2.41 82,20.64
  Bottom Layer w0.127: v1(82,46.08) 82,38.77 82.01,38.76 v1(82.01,20.64)
DA5: length 39.5
  Top Layer w0.127: U20.135 81.94,48 82.51,47.43 v1(82.51,46.62) ; U2.42 82.51,21.14 v1(82.51,21.14)
  Bottom Layer w0.127: v1(82.51,46.62) v1(82.51,21.14)
DA6: length 40.6
  Top Layer w0.127: 72.67,21.65 U2.43 83.02,21.64 v1(83.02,21.65) ; v1(83.02,46.07) 83.02,47.94 82.46,48.5 U20.136
  Bottom Layer w0.127: v1(83.02,21.65) v1(83.02,46.07)
DA7: length 41.5
  Top Layer w0.127: v1(83.53,22.16) 72.68,22.16 U2.44 ; U20.137 82.85,49 83.53,48.32 v1(83.53,46.65)
  Bottom Layer w0.127: v1(83.53,22.16) v1(83.53,46.65)
DAC0: length 48.5
  Top Layer w0.127: U20.40 57.73,50.98 v1(56.1,50.98)
  Bottom Layer w0.127: CH1控制信号.2 92.42,71.31 72.48,51.37 72.48,49.84 72.35,49.72 70.32,49.72 69.94,50.1 59.27,50.1 58.38,50.98 v1(56.1,50.98)
DAC1: length 46
  Top Layer w0.127: U20.41 56.37,50.5 v1(56.1,50.22) ; CH2控制信号.2 92.29,60.76 v1(86.07,60.76)
  Bottom Layer w0.127: v1(86.07,60.76) 84.93,60.76 76.8,52.64 74.76,52.64 74,51.87 74,48.83 73.62,48.44 61.18,48.44 59.91,49.72 56.35,49.72 55.97,50.1 v1(56.1,50.22)
DB0: length 43.1
  Top Layer w0.127: v1(68.03,22.79) 68.03,21.01 65.66,18.64 U2.24 ; U20.139 79.31,49.97 73.24,49.97 72.35,49.08 v1(72.35,34.86)
  Bottom Layer w0.127: v1(72.35,34.86) 72.35,28.63 70.57,26.86 68.8,26.86 68.03,26.09 v1(68.03,22.79)
DB1: length 43.4
  Top Layer w0.127: U20.140 79.32,50.48 72.35,50.48 71.59,49.72 v1(71.59,34.98) ; v1(67.15,22.79) 67.15,21.01 65.28,19.14 U2.23
  Bottom Layer w0.127: v1(71.59,34.98) 71.59,28.63 70.14,27.19 68.36,27.19 67.15,25.97 v1(67.15,22.79)
DB2: length 27
  Top Layer w0.127: U20.69 55.83,36.5 55.59,36.25 55.59,20.5 56.48,19.62 64.14,19.62 U2.22
DB3: length 24.9
  Top Layer w0.127: U20.70 57.74,36 56.35,36 56.22,35.87 56.22,20.76 56.84,20.14 U2.21
DB4: length 16.3
  Top Layer w0.127: U2.20 60.53,20.64 59.78,21.39 ; U20.73 59.79,31.06 v1(59.78,31.05)
  Bottom Layer w0.127: v1(59.78,21.39) 59.78,31.04 v1(59.78,31.05)
DB5: length 14.9
  Top Layer w0.127: U2.19 61.55,21.14 v1(60.41,22.28) ; 60.29,31.56 60.29,32.94 U20.74
  Bottom Layer w0.127: v1(60.41,22.28) 60.29,22.41 v1(60.29,31.55)
DB6: length 13.8
  Top Layer w0.127: v1(60.79,30.92) 60.79,32.94 U20.75 ; v1(60.8,23.13) 62.28,21.65 64.16,21.65 U2.18
  Bottom Layer w0.127: v1(60.8,23.13) 60.79,23.13 v1(60.79,30.92)
DB7: length 12.8
  Top Layer w0.127: U2.17 62.84,22.14 61.29,23.69 ; U20.76 61.29,31.56 v1(61.3,31.55)
  Bottom Layer w0.127: v1(61.3,23.65) 61.3,23.66 v1(61.3,31.55)
DIO: length 20.6
  Top Layer w0.127: U20.105 75.79,34.01 76,34.22 85.38,34.22 86.22,33.38 ; 86.22,33.38 86.27,33.33 ; 86.22,33.38 87.54,33.38 SWD.2 ; 86.22,33.38 U4.1
DIO-CLKA: length 10.7
  Top Layer w0.127: U2.47 73.71,23.64 73.88,23.81 73.88,24.82 73.24,25.46 v1(73.24,26.47) ; U20.100 v1(73.29,31.45)
  Bottom Layer w0.127: v1(73.24,26.47) 73.29,26.53 v1(73.29,31.45)
DIO-CLKB: length 29.2
  Top Layer w0.127: v1(73.88,36.13) 73.88,33.03 U20.101 ; v1(64.99,27.36) 62.06,27.36 61.81,27.11 61.81,24.31 62.48,23.64 U2.14
  Bottom Layer w0.127: v1(73.88,36.13) 65.62,36.13 64.99,35.49 v1(64.99,27.36)
DIO-RA0: length 52.6
  Top Layer w0.127: v1(84.54,46.63) 84.54,61.14 85.56,62.16 93.05,62.16 94.32,63.43 94.32,72.07 CH1控制信号.3 ; U20.111 84.67,36 v1(84.67,36)
  Bottom Layer w0.127: v1(84.54,46.63) 84.67,46.5 v1(84.67,36)
DIO-RA1: length 39
  Top Layer w0.127: v1(84.04,46.02) 84.04,61.65 85.69,63.3 92.29,63.3 CH2控制信号.3 ; U20.112 84.03,36.5 v1(84.04,36.51)
  Bottom Layer w0.127: v1(84.04,36.51) v1(84.04,46.02)
DIO-S1: length 7.8
  Top Layer w0.127: v1(68.17,27.7) 67.66,27.2 U2.8 ; U20.91 68.79,31.55 v1(68.03,30.79)
  Bottom Layer w0.127: 68.16,27.74 68.03,27.88 v1(68.03,30.79)
DIO-S2: length 9.3
  Top Layer w0.127: U20.92 69.29,31.03 68.54,30.28 v1(67.15,30.28) ; U2.9 67.16,27.36
  Bottom Layer w0.127: v1(67.15,27.24) 67.15,30.41
DOWN: length 14.2
  Top Layer w0.127: U20.128 89.74,44.5 按键.5
FMC_A0: length 45.8
  Top Layer w0.127: 72.86,54.61 U20.10 72.79,55.62 77.69,60.51 v1(77.69,69.02) ; U21.23 v1(70.79,68.98)
  Bottom Layer w0.127: v1(70.79,68.98) 70.83,69.02 v1(77.69,69.02)
FMC_A1: length 45.7
  Top Layer w0.127: v1(77.05,69.78) 77.05,60.76 72.29,56 U20.11 ; U21.24 v1(70.57,69.78)
  Bottom Layer w0.127: 77.05,69.78 v1(70.57,69.78)
FMC_A2: length 45.8
  Top Layer w0.127: U21.25 70.54,70.58 v1(70.57,70.54) ; U20.12 71.79,56.39 76.42,61.02 v1(76.42,70.54)
  Bottom Layer w0.127: v1(76.42,70.54) v1(70.57,70.54)
FMC_A3: length 45.5
  Top Layer w0.127: 71.34,54.59 U20.13 71.29,56.66 75.53,60.89 75.53,71.05 75.2,71.38 U21.26
FMC_A4: length 58.2
  Top Layer w0.127: U21.29 40.8,71.38 42.89,73.46 69.56,73.46 v1(69.69,73.34) ; U20.14 70.79,57.05 74.64,60.89 74.64,67.75 74.13,68.26 v1(70.83,68.26)
  Bottom Layer w0.127: v1(70.83,68.26) 69.94,68.26 69.69,68.51 v1(69.69,73.34)
FMC_A5: length 56.5
  Top Layer w0.127: U21.30 41.02,70.58 43.27,72.83 67.91,72.83 v1(68.16,72.58) ; v1(68.29,67.37) 68.41,67.24 69.56,67.24 70.29,66.51 73.47,66.51 74,65.97 74,61.14 70.29,57.43 U20.15
  Bottom Layer w0.127: v1(68.29,67.37) 68.16,67.5 v1(68.16,72.58)
FMC_A6: length 43.6
  Top Layer w0.127: U20.50 46.35,46 45.94,46.41 45.94,68.89 44.92,69.91 37.37,69.91 U21.31
FMC_A7: length 51
  Top Layer w0.127: U20.53 v1(47.19,44.5) ; v1(34.25,44.51) 33.24,45.52 33.24,66.61 35.52,68.89 37.16,68.89 U21.32
  Bottom Layer w0.127: v1(34.25,44.51) 34.26,44.5 v1(47.19,44.5)
FMC_A8: length 43.8
  Top Layer w0.127: U20.54 45.94,44 45.3,44.63 45.3,67.24 44.28,68.26 37.32,68.26 U21.33
FMC_A9: length 43.6
  Top Layer w0.127: U21.34 37.26,67.37 43.9,67.37 44.67,66.61 44.67,44.13 45.3,43.5 U20.55
FMC_A10: length 42.2
  Top Layer w0.127: U20.56 44.53,43 43.9,43.62 v1(43.9,66.35) ; v1(46.95,68.13) 48.48,68.13 U21.22
  Bottom Layer w0.127: v1(46.95,68.13) 45.68,68.13 v1(43.9,66.35)
FMC_A11: length 43.6
  Top Layer w0.127: U20.57 43.88,42.5 43.27,43.11 43.27,65.46 42.13,66.61 37.27,66.61 U21.35
FMC_A12: length 71.2
  Top Layer w0.127: U21.36 36.09,65.78 34,63.69 34,46.29 35.65,44.64 v1(35.65,33.46) ; U20.87 66.76,32.97 v1(66.76,36.63)
  Bottom Layer w0.127: v1(66.76,36.63) 61.81,36.63 58.64,33.46 v1(35.65,33.46)
FMC_BA0: length 51.1
  Top Layer w0.127: U20.89 67.79,44.88 67.15,45.52 v1(67.15,52.76) ; v1(54.83,59.75) 60.29,59.75 62.32,57.72 v1(62.32,56.7) ; U21.20 48.56,66.61 v1(54.83,66.61)
  Bottom Layer w0.127: v1(62.32,56.7) 62.32,53.14 62.57,52.89 67.02,52.89 v1(67.15,52.76) ; v1(54.83,59.75) v1(54.83,66.61)
FMC_BA1: length 59.7
  Top Layer w0.127: U21.21 67.26,67.38 68.92,65.72 72.48,65.72 72.86,65.34 72.86,61.65 68.67,57.46 v1(68.67,56.06) ; v1(68.92,51.49) 68.92,34.64 68.29,34.01 U20.90
  Bottom Layer w0.127: v1(68.67,56.06) 68.67,51.75 v1(68.92,51.49)
FMC_D0: length 32.7
  Top Layer w0.127: U21.2 49.95,52.18 v1(50,52.13) ; v1(60.16,51.37) 64.99,46.54 64.99,36.13 65.79,35.32 U20.85
  Bottom Layer w0.127: v1(50,52.13) 59.4,52.13 v1(60.16,51.37)
FMC_D1: length 34.4
  Top Layer w0.127: U21.4 v1(50,53.78) ; v1(60.54,52.34) 66.26,46.63 66.26,32.98 U20.86
  Bottom Layer w0.127: v1(50,53.78) 59.14,53.78 60.54,52.38
FMC_D2: length 46.3
  Top Layer w0.127: v1(59.78,48.95) 62.32,46.41 v1(62.32,37.4) ; U20.114 73.9,37.5 v1(73.88,37.52) ; v1(50.63,49.21) 50.63,54.29 50.34,54.58 U21.5
  Bottom Layer w0.127: v1(73.88,37.52) 62.45,37.52 v1(62.32,37.4) ; v1(50.63,49.21) 50.89,48.95 v1(59.78,48.95)
FMC_D3: length 46.5
  Top Layer w0.127: U20.115 79.31,38.03 v1(73.24,38.03) ; v1(54.19,56.19) v1(54.19,51.49) ; v1(59.78,50.73) 63.21,47.3 v1(63.21,38.03) ; U21.7 v1(50.25,56.18)
  Bottom Layer w0.127: v1(54.19,56.19) 50.27,56.19 v1(50.25,56.18) ; v1(63.21,38.03) v1(73.24,38.03) ; v1(54.19,51.49) 59.02,51.49 v1(59.78,50.73)
FMC_D4: length 29.4
  Top Layer w0.127: U21.8 50.86,56.98 51.27,56.57 51.27,56.25 51.52,55.99 51.52,54.72 51.27,54.47 51.27,53.2 51.52,52.95 51.52,51.68 51.27,51.42 51.27,50.15 51.52,49.9 51.52,48.63 51.27,48.37 v1(51.27,48.06) ; U20.58 57.64,42.09 51.65,42.09 51.4,41.84 v1(50.89,41.84)
  Bottom Layer w0.127: v1(51.27,48.06) 50.89,47.68 50.89,47.4 50.76,47.27 50.35,47.27 50.23,47.14 50.23,45.87 50.35,45.75 50.76,45.75 50.89,45.62 50.89,44.97 50.76,44.85 49.37,44.85 49.24,44.72 49.24,43.45 49.37,43.32 49.75,43.32 49.87,43.2 49.87,41.97 50,41.84 v1(50.89,41.84)
FMC_D5: length 28.7
  Top Layer w0.127: U21.10 49.58,58.58 49.83,58.33 51.1,58.33 51.36,58.58 51.55,58.58 52.03,58.1 52.03,57.75 52.29,57.5 52.29,56.23 52.03,55.98 52.03,54.71 52.29,54.45 52.29,53.18 52.03,52.93 52.03,51.66 52.29,51.41 52.29,50.14 52.03,49.88 v1(52.03,47.43) ; v1(52.03,41.59) 57.65,41.59 U20.59
  Bottom Layer w0.127: v1(52.03,47.43) 52.03,46.98 51.91,46.86 51.52,46.86 51.4,46.73 51.4,45.46 51.52,45.33 51.91,45.33 52.03,45.2 52.03,43.93 51.91,43.81 51.52,43.81 51.4,43.68 51.4,42.41 51.52,42.28 51.91,42.28 52.03,42.16 v1(52.03,41.59)
FMC_D6: length 29.6
  Top Layer w0.127: U21.11 49.56,59.38 49.69,59.25 49.69,59.11 49.82,58.99 51.09,58.99 51.22,59.11 51.22,59.25 51.34,59.38 52.02,59.38 52.79,58.61 52.79,58.05 52.92,57.93 52.97,57.93 53.1,57.8 53.1,56.53 52.97,56.4 52.92,56.4 52.79,56.28 52.79,55.01 52.92,54.88 52.97,54.88 53.1,54.75 53.1,53.48 52.97,53.36 52.92,53.36 52.79,53.23 52.79,51.96 52.92,51.83 52.97,51.83 53.1,51.7 53.1,50.43 52.97,50.31 52.92,50.31 52.79,50.18 v1(52.79,48.19) ; v1(52.79,41.08) 57.66,41.08 U20.60
  Bottom Layer w0.127: v1(52.79,41.08) 52.79,42.44 52.67,42.57 52.49,42.57 52.36,42.7 52.36,43.97 52.49,44.09 52.67,44.09 52.79,44.22 52.79,45.49 52.67,45.62 52.53,45.62 52.4,45.74 52.4,47.01 52.53,47.14 52.67,47.14 52.79,47.27 v1(52.79,48.19)
FMC_D7: length 32.5
  Top Layer w0.127: v1(53.43,47.3) 53.43,48.98 53.56,49.11 53.81,49.11 53.94,49.23 53.94,50.5 53.81,50.63 53.56,50.63 53.43,50.76 53.43,52.03 53.56,52.16 53.73,52.16 53.86,52.28 53.86,53.55 53.73,53.68 53.56,53.68 53.43,53.81 53.43,55.08 53.68,55.33 53.68,56.6 53.43,56.86 53.43,58.12 53.56,58.25 53.81,58.25 53.94,58.38 53.94,59.65 53.81,59.78 53.56,59.78 53.43,59.9 53.43,60.26 52.71,60.98 U21.13 ; v1(53.43,39.56) 53.56,39.43 57.81,39.43
  Bottom Layer w0.127: v1(53.43,47.3) v1(53.43,39.56)
FMC_D8: length 41.6
  Top Layer w0.127: U20.64 57.69,39.05 42.89,39.05 42.38,39.56 42.38,60 41.4,60.98 U21.42
FMC_D9: length 40.6
  Top Layer w0.127: U21.44 37.26,59.37 41.11,59.37 41.87,58.61 41.87,39.05 42.42,38.5 U20.65
FMC_D10: length 40.6
  Top Layer w0.127: U20.66 41.91,38 41.49,38.41 41.49,58.22 41.11,58.61 37.27,58.61 U21.45
FMC_D11: length 39.7
  Top Layer w0.127: U20.67 41.52,37.5 40.86,38.16 40.86,56.95 40.73,57.08 37.35,57.08 U21.47
FMC_D12: length 39.2
  Top Layer w0.127: U21.48 39.98,56.18 40.22,55.94 40.22,37.52 40.75,37 U20.68
FMC_D13: length 47.4
  Top Layer w0.127: v1(52.67,30.67) 45.56,30.67 39.71,36.51 39.71,54.29 39.42,54.58 U21.50 ; v1(59.14,30.54) 59.32,30.36 61.51,30.36 61.79,30.65 U20.77
  Bottom Layer w0.127: v1(59.14,30.54) 59.02,30.67 v1(52.67,30.67)
FMC_D14: length 48.4
  Top Layer w0.127: v1(52.09,30.03) 44.41,30.03 39.21,35.24 39.21,53.4 38.7,53.91 37.37,53.91 U21.51 ; v1(58.38,30.03) 62.06,30.03 62.29,30.26 U20.78
  Bottom Layer w0.127: v1(52.09,30.03) v1(58.38,30.03)
FMC_D15: length 48.6
  Top Layer w0.127: v1(52.54,29.52) 42.89,29.52 38.57,33.84 38.57,51.82 38.21,52.18 U21.53 ; U20.79 62.79,30 62.28,29.48 57.66,29.48 v1(57.62,29.52)
  Bottom Layer w0.127: v1(52.54,29.52) v1(57.62,29.52)
FMC_SDCKE: length 33.1
  Top Layer w0.127: v1(40.6,64.95) 40.58,64.98 U21.37 ; U20.29 63.29,58.14 58.64,62.8 v1(50.66,62.8)
  Bottom Layer w0.127: v1(50.66,62.8) 41.62,62.8 40.6,63.81 v1(40.6,64.95)
FMC_SDCLK: length 68.9
  Top Layer w0.127: v1(69.81,52.13) 69.81,32.97 U20.93 ; U21.38 v1(41.49,64.18) ; v1(69.81,57.72) 73.37,61.27 v1(73.37,64.19) ; v1(71.59,64.19) 50.21,64.19 v1(50.2,64.18)
  Bottom Layer w0.127: v1(41.49,64.18) v1(50.2,64.18) ; v1(71.59,64.19) v1(73.37,64.19) ; v1(69.81,57.72) v1(69.81,52.13)
FMC_SDNCAS: length 55.5
  Top Layer w0.127: U20.132 79.3,46.54 v1(77.18,46.54) ; U21.17 49.48,64.18 50.13,64.83 72.1,64.83 72.35,64.57 72.35,61.91 67.65,57.21 v1(67.65,56.06) ; v1(67.65,52.21) v1(67.65,47.17)
  Bottom Layer w0.127: v1(67.65,56.06) v1(67.65,52.21) ; v1(67.65,47.17) 68.29,46.54 v1(77.18,46.54)
FMC_SDNE: length 24.5
  Top Layer w0.127: U21.19 58.32,65.78 v1(58.38,65.84) 59.4,65.84 ; v1(59.78,62.67) 63.84,58.61 63.84,54.6 U20.28
  Bottom Layer w0.127: v1(59.78,62.67) 58.38,64.07 v1(58.38,65.84)
FMC_SDNWE: length 22.4
  Top Layer w0.127: U21.16 60.21,63.38 64.66,58.93 64.66,54.67 U20.26
FMC_SDRAS: length 31.4
  Top Layer w0.127: U21.18 48.5,64.95 46.82,64.95 46.44,64.57 46.44,46.92 46.87,46.5 U20.49
HC-A0: length 30.9
  Top Layer w0.127: U20.102 74.29,31.14 75.53,29.9 v1(75.53,27.62)
  Bottom Layer w0.127: v1(75.53,27.62) 79.08,27.62 79.59,27.11 79.59,15.04 74.38,9.84 CH1档位选择.1
HC-A1: length 41.4
  Top Layer w0.127: U20.96 71.29,30.71 72.48,29.52 73.75,29.52 73.88,29.39 73.88,25.97 74.13,25.71 77.69,25.71 77.94,25.46
  Bottom Layer w0.127: CH2档位选择.1 62.45,12.12 62.7,12.38 71.08,12.38 78.01,19.31 v1(78.01,25.39)
HC-B0: length 31.2
  Top Layer w0.127: v1(76.16,28.12) 76.03,28.25 76.03,30.25 74.79,31.5 U20.103
  Bottom Layer w0.127: v1(76.16,28.12) 79.46,28.12 80.23,27.36 80.23,10.98 79.46,10.22 77.43,10.22 76.92,9.71 CH1档位选择.2
HC-B1: length 37.9
  Top Layer w0.127: U20.97 71.79,30.84 72.1,30.54 73.5,30.54 74.38,29.65 74.38,26.35
  Bottom Layer w0.127: v1(74.46,26.28) 78.14,26.28 78.57,25.84 78.57,18.09 70.83,10.34 66.98,10.34 65.2,8.57
HC-C0: length 29.3
  Top Layer w0.127: v1(76.8,28.63) 76.8,30.03 75.29,31.53 U20.104
  Bottom Layer w0.127: CH1档位选择.3 79.59,8.57 79.84,8.57 80.73,9.46 80.73,27.87 79.97,28.63 v1(76.8,28.63)
HC-C1: length 36.6
  Top Layer w0.127: U20.98 72.29,31.49 72.86,30.92 73.88,30.92 74.89,29.9 v1(74.89,26.98)
  Bottom Layer w0.127: v1(74.89,26.98) 78.83,26.98 79.08,26.73 79.08,17.33 70.32,8.57 67.65,8.57 CH2档位选择.3
LEFT: length 13.3
  Top Layer w0.127: U20.127 91.78,44 按键.4
OSC_IN: length 11
  Top Layer w0.127: 69.9,63.04 69.54,63.04 68.54,62.03 68.54,60.26 68.41,60.13 67.33,60.13 66.06,58.86 66.29,58.63 U20.23
OSC_OUT: length 9.7
  Top Layer w0.127: U20.24 65.75,54.59 65.75,57.46 65.11,58.1 C15.2 67.65,61.33 67.7,61.29
REFO: length 14.1
  Top Layer w0.127: C10.2 66.64,28.22 ; 66.64,28.22 C11.2 69.15,28.22 C12.2 ; 66.64,28.22 66.66,28.19 U2.10 ; C12.2 69.16,28.17 U2.5 U2.6 U2.7 ; C12.2 69.24,28.25 70.07,28.25 ; 70.07,28.25 71.14,28.25 C13.2 ; 70.07,28.25 70.16,28.15 U2.3
RIGHT: length 13.7
  Top Layer w0.127: U20.126 91.02,43.5 按键.3
RLY0: length 52.9
  Top Layer w0.127: v1(89.75,57.21) 91.15,55.81 92.67,55.81 94.07,54.41 94.07,36.63 93.25,35.82 89.93,35.82 87.21,38.54 83.91,38.54 82.38,37.02 80.35,37.02 80.33,37 U20.113
  Bottom Layer w0.127: CH1控制信号.1 89.75,66.22 v1(89.75,57.21)
RLY1: length 39.8
  Top Layer w0.127: v1(85.81,35.5) U20.110
  Bottom Layer w0.127: CH2控制信号.1 95.21,55.56 95.21,35.66 95.05,35.5 v1(85.81,35.5)
UART_SCREEN_RX: length 41.1
  Top Layer w0.127: U20.35 60.29,55.61 59.71,56.19 58.25,56.19 57.75,56.7 v1(57.75,58.35)
  Bottom Layer w0.127: v1(57.75,58.35) 57.75,74.35 62.06,78.67 62.06,81.59 64.1,83.62 67.65,83.62 70.45,80.83
UART_SCREEN_TX: length 29.2
  Top Layer w0.127: U20.34 v1(60.79,57.97)
  Bottom Layer w0.127: 67.91,80.83 63.08,76 63.08,60.26 v1(60.79,57.97)
UP: length 15
  Top Layer w0.127: 按键.6 87.7,45 U20.129
USART_COMPUTER_RX: length 28.9
  Top Layer w0.127: v1(56.35,57.84) 56.35,53.89 U20.37
  Bottom Layer w0.127: v1(56.35,57.84) 上位机串口.3
USART_COMPUTER_TX: length 35.3
  Top Layer w0.127: v1(56.99,58.48) 56.99,55.18 57.62,54.55 U20.36
  Bottom Layer w0.127: v1(56.99,58.48) 56.99,74.61 57.75,75.37 57.75,82.35 57.49,82.61 55.59,82.61 上位机串口.2
$1N2975: length 3.5
  Top Layer w0.254: LED1.2 R2.2
$1N11209: length 8.7
  Top Layer w0.127: 65.29,54.42 65.29,57.16 v1(65.24,57.21) ; C56.1 60.07,57.42 v1(60.16,57.33)
  Bottom Layer w0.127: v1(65.24,57.21) 65.11,57.33 v1(60.16,57.33)
$1N11468: length 8.6
  Top Layer w0.127: U20.71 v1(59.14,35.5) ; v1(53.43,35.24) C57.2
  Bottom Layer w0.127: v1(59.14,35.5) 58.88,35.24 v1(53.43,35.24)
$1N11827: length 5.4
  Top Layer w0.127: U20.106 76.29,31.43 v1(76.29,31.43)
  Bottom Layer w0.127: v1(76.29,31.43) 76.29,35.3
$1N12049: length 2.6
  Top Layer w0.127: 81.95,52 81.95,52 U20.143
$1N12147: length 2.6
  Top Layer w0.127: R41.1 81.1,49.5 U20.138
$3N6846: length 4.3
  Top Layer w0.127: 45.22,27.86 45.15,27.93 40.98,27.93
$3N6849: length 8.7
  Top Layer w0.127: 45.22,25.85 46.3,25.85 46.57,25.59 46.57,24.57 46.06,24.06
  Top Layer w0.254: X4.3 44.98,24.06 46.06,24.06
$3N6852: length 21.3
  Top Layer w0.127: 45.22,26.86 43.52,26.86 42.63,25.97 42.63,23.93 41.75,23.04 36.69,23.04 C52.1 32.82,26.92 C51.2
$3N6863: length 18.6
  Top Layer w0.508: U14.2 26.12,22.92
  Top Layer w0.762: R7.2 R6.1
  Bottom Layer w0.508: v1(26.25,22.92) 26.25,28.38 22.31,32.32 R6.1
$3N6866: length 51.6
  Top Layer w0.508: U14.1 24.45,20.51 ; 24.45,20.51 23.56,19.62 v1(22.95,19.62) ; 24.45,20.51 24.45,12.27 信号发生器.2 信号发生器.1 ; v1(13.93,19.62) 9.36,24.19 PR1.2
  Top Layer w0.762: PR1.2 6.19,26.35 6.19,36.97 U11.1
  Bottom Layer w0.508: v1(13.93,19.62) v1(22.95,19.62)
$3N6867: length 20.9
  Top Layer w0.762: PR1.3 12.41,30.75 12.41,40.57 14.61,42.78 R7.1
$3N6868: length 8.9
  Top Layer w0.127: C69.2 49.24,23.3 47.71,24.82 47.71,27.62 47.95,27.86 U9.10
$3N6869: length 32
  Top Layer w0.254: C69.1 46.82,16.19 31.08,16.19 28.66,18.6 28.66,23.3 27.65,24.31 24.58,24.31 U14.3

## Copper pours and planes (outline as drawn; the poured copper is in the pictures)
-12V on Top Layer: -0.8,90.23 32.22,90.23 32.22,-1.09 -0.8,-1.09
GND on Top Layer: -5.75,92.01 106.77,92.01 106.77,-5.15 -5.75,-5.15
GND on Bottom Layer: -6.9,92.51 107.91,92.51 107.91,-9.21 -6.9,-9.21

Small or netless copper shapes (teardrops, artwork), in the pictures only: 619 on Top Layer, 225 on Bottom Layer

## Text on the board
Top Silkscreen Layer: +12V | GND | 2026.5.26 | -12V | OUT | +5V | TX | RX | HC-A1 | HC-B1 | HC-C1 | HC-A0 | HC-B0 | HC-C0 | DIO-RA1 | DIO-RA0 | DAC0 | RLY0 | DOWN | RIGHT | CONF | +3V3 | FUNC | DAC1 | RLY1 | LEFT | CLK | DIO | UP | 示波发生
